# Altium schematic sheet 02_Power_RFFE_diag.SchDoc: Power + RF Front End diagram
size A4; Organization: Lime Microsystems; Address1: Surrey Tech Centre; Address2: Guildford GU2 7YG; Address3: Surrey; Address4: United Kingdom; Revision: v1.2; SheetNumber: 2; SheetTotal: 13
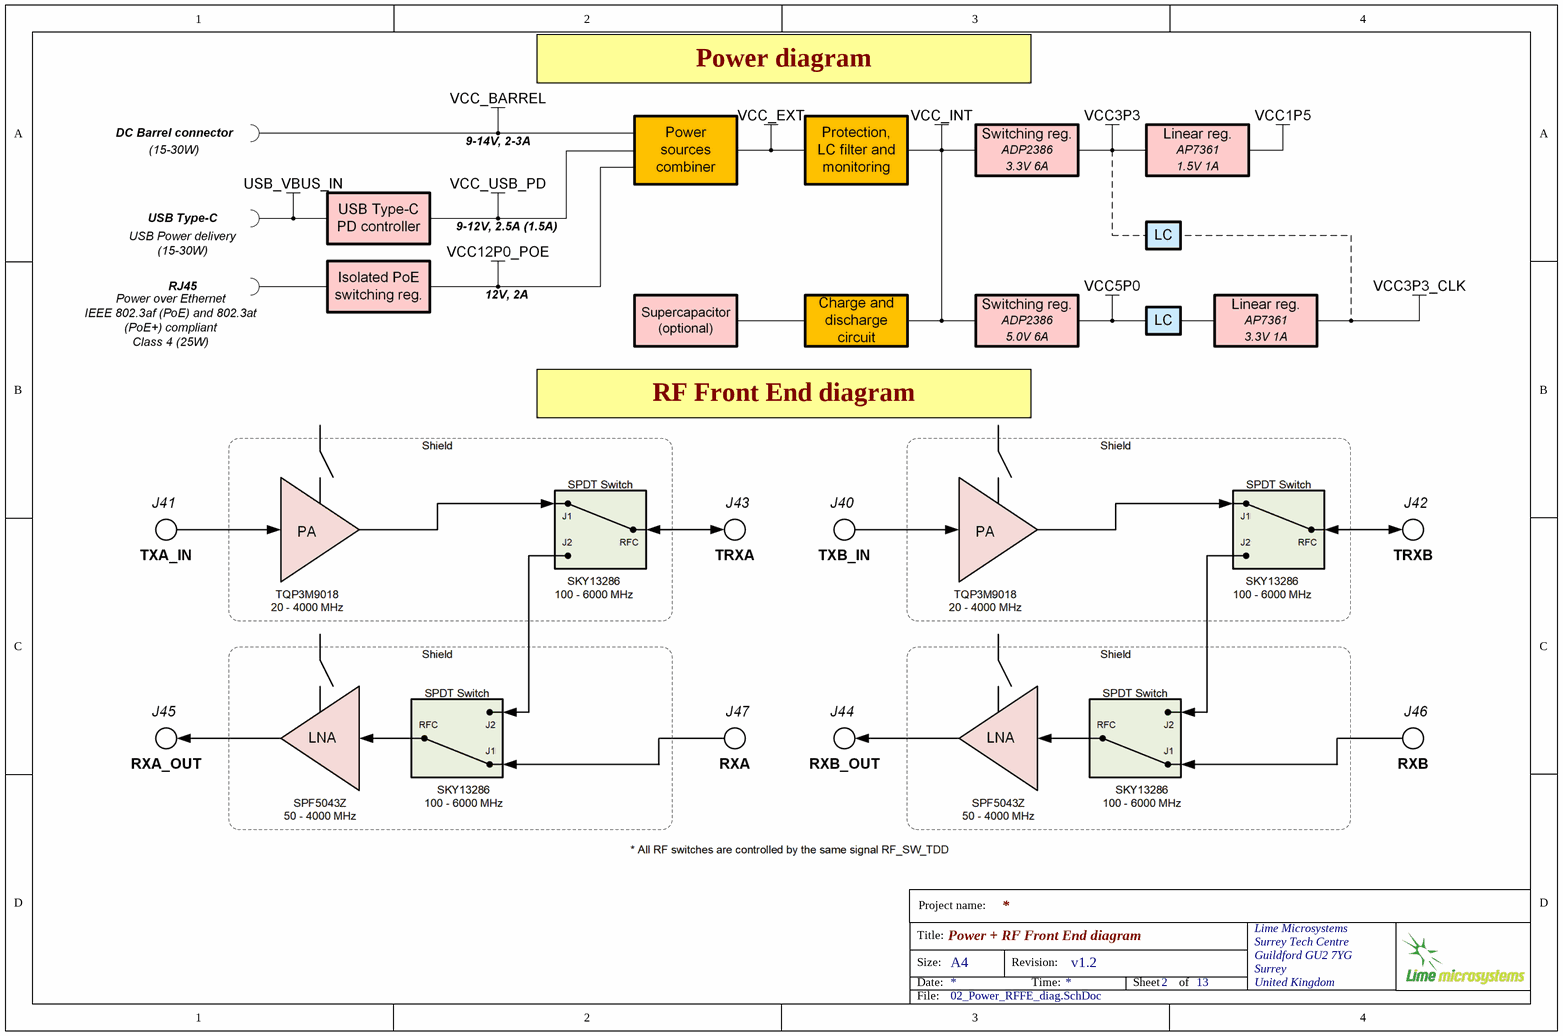
[diagram p0: 02_Power_RFFE_diag.SchDoc]

## Notes on the sheet
- Power diagram
- RF Front End diagram
- Project name:
- Title:
- Size:
- Date:
- A4
- Revision:
- Time:
- Sheet
- of
- File: